# Altium schematic sheet [03] - CPU - SIGNAL, USB, JTAG.SchDoc: Project
size A4; Organization: Tor Brodtkorb; Address1: Frode Rinnans veg 193; Address2: 7050 Trondheim; DocumentNumber: 6598; Revision: 1.0; SheetNumber: 1; SheetTotal: 1
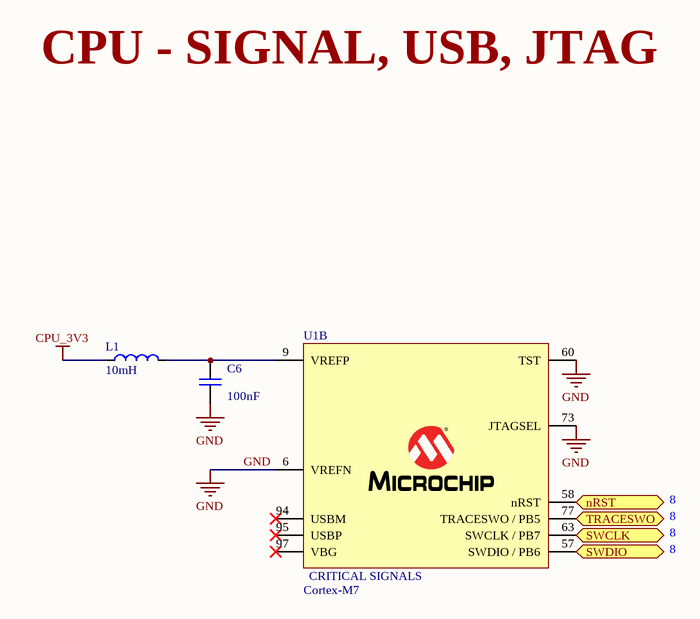
[diagram p0: [03] - CPU - SIGNAL, USB, JTAG.SchDoc]

## Parts
C6  value 100nF  [C0603]  (hidden comment: 02016D104KAT2A)
L1  value 10mH  [Inductor 0603]  (hidden comment: MLZ1608A2R2WT)
U1  Cortex-M7  [ATSAMS70N19A-AN]  (part B of 3)

## Ports
nRST (bidir), SWCLK (bidir), SWDIO (bidir), TRACESWO (bidir)

## Nets
CPU_3V3: L1.1
GND: C6.1 U1.6(VREFN) U1.60(TST) U1.73(JTAGSEL)
nRST: U1.58(nRST) ; port nRST
SWCLK: U1.63(SWCLK_/_PB7) ; port SWCLK
SWDIO: U1.57(SWDIO_/_PB6) ; port SWDIO
TRACESWO: U1.77(TRACESWO_/_PB5) ; port TRACESWO
NetC6_2: C6.2 L1.2 U1.9(VREFP)

Not connected (* = marked no-connect by the designer): U1 94(USBM)* 95(USBP)* 97(VBG)*

## Notes on the sheet
- CPU - SIGNAL, USB, JTAG
- 8
- Title
- Size:
- Date:
- A4
- Number:
- Time:
- Revision:
- Sheet
- of
- File:
- (in symbol ATSAMS70N19A-AN, part B) CRITICAL SIGNALS

## Library data of the parts
C6 = 02016D104KAT2A: C0603
L1 = MLZ1608A2R2WT: Inductor 0603
U1 = ATSAMS70N19A-AN: ATSAMS70N19